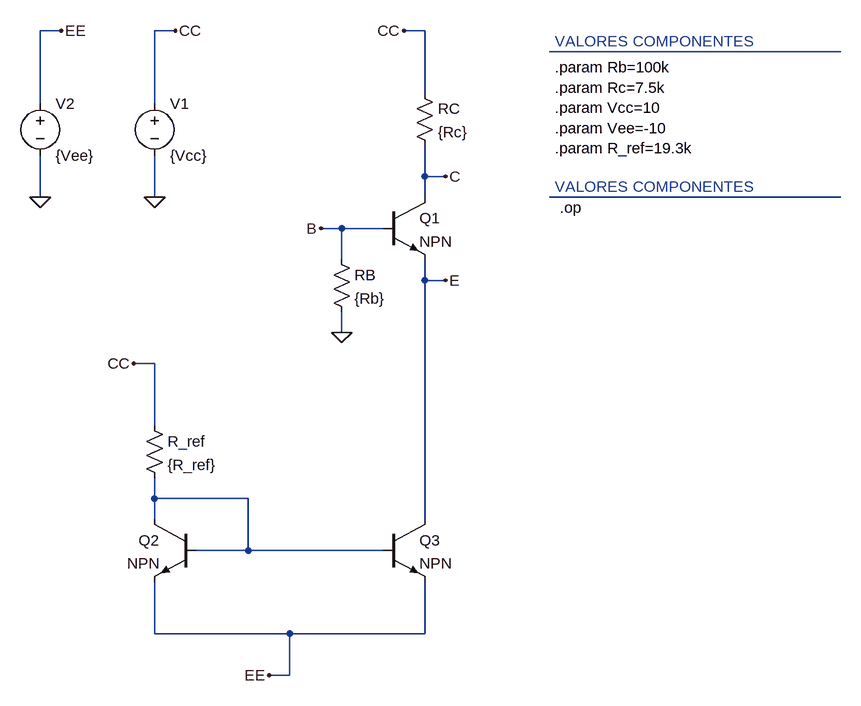
[diagram p0: schematic ejemplo4.asc]
ejemplo4.asc, the LTspice schematic file:
Version 4
SHEET 1 1064 924
WIRE -240 -128 -272 -128
WIRE -64 -128 -96 -128
WIRE 320 -128 288 -128
WIRE 960 -96 512 -96
WIRE 320 -32 320 -128
WIRE -272 -16 -272 -128
WIRE -96 -16 -96 -128
WIRE 320 96 320 48
WIRE 352 96 320 96
WIRE -272 128 -272 64
WIRE -96 128 -96 64
WIRE 320 128 320 96
WIRE 960 128 512 128
WIRE 192 176 160 176
WIRE 256 176 192 176
WIRE 192 224 192 176
WIRE 320 256 320 224
WIRE 352 256 320 256
WIRE 192 336 192 304
WIRE -96 384 -128 384
WIRE -96 480 -96 384
WIRE -96 592 -96 560
WIRE 48 592 -96 592
WIRE -96 624 -96 592
WIRE 320 624 320 256
WIRE 48 672 48 592
WIRE 48 672 -32 672
WIRE 256 672 48 672
WIRE -96 800 -96 720
WIRE 112 800 -96 800
WIRE 320 800 320 720
WIRE 320 800 112 800
WIRE 112 864 112 800
WIRE 112 864 80 864
FLAG -96 128 0
FLAG 160 176 B
FLAG 352 96 C
FLAG 352 256 E
FLAG -64 -128 CC
FLAG 288 -128 CC
FLAG -272 128 0
FLAG -240 -128 EE
FLAG 192 336 0
FLAG -128 384 CC
FLAG 80 864 EE
SYMBOL voltage -96 -32 R0
WINDOW 123 0 0 Left 0
WINDOW 39 0 0 Left 0
SYMATTR InstName V1
SYMATTR Value {Vcc}
SYMBOL res 304 -48 R0
SYMATTR InstName RC
SYMATTR Value {Rc}
SYMBOL npn 256 128 R0
SYMATTR InstName Q1
SYMBOL voltage -272 -32 R0
WINDOW 123 0 0 Left 0
WINDOW 39 0 0 Left 0
SYMATTR InstName V2
SYMATTR Value {Vee}
SYMBOL res 176 208 R0
SYMATTR InstName RB
SYMATTR Value {Rb}
SYMBOL npn -32 624 M0
SYMATTR InstName Q2
SYMBOL npn 256 624 R0
SYMATTR InstName Q3
SYMBOL res -112 464 R0
SYMATTR InstName R_ref
SYMATTR Value {R_ref}
TEXT 520 -112 Left 2 ;VALORES COMPONENTES
TEXT 520 -72 Left 2 !.param Rb=100k \n.param Rc=7.5k \n.param Vcc=10 \n.param Vee=-10\n.param R_ref=19.3k
TEXT 520 112 Left 2 ;VALORES COMPONENTES
TEXT 528 144 Left 2 !.op

The netlist it stands for:
* ejemplo4.asc
V1 CC 0 {Vcc}
RC CC C {Rc}
Q1 C B E 0 NPN
V2 EE 0 {Vee}
RB B 0 {Rb}
Q2 N003 N003 EE 0 NPN
Q3 E N003 EE 0 NPN
R_ref CC N003 {R_ref}
.model NPN NPN
.model PNP PNP
.lib standard.bjt
* VALORES COMPONENTES
.param Rb=100k
.param Rc=7.5k
.param Vcc=10
.param Vee=-10
.param R_ref=19.3k
* VALORES COMPONENTES
.op
.backanno
.end